# Altium schematic sheet ZYNQ_PL_Bank_33.SchDoc
size A4; DocumentNumber: 5; SheetNumber: 5; SheetTotal: 47
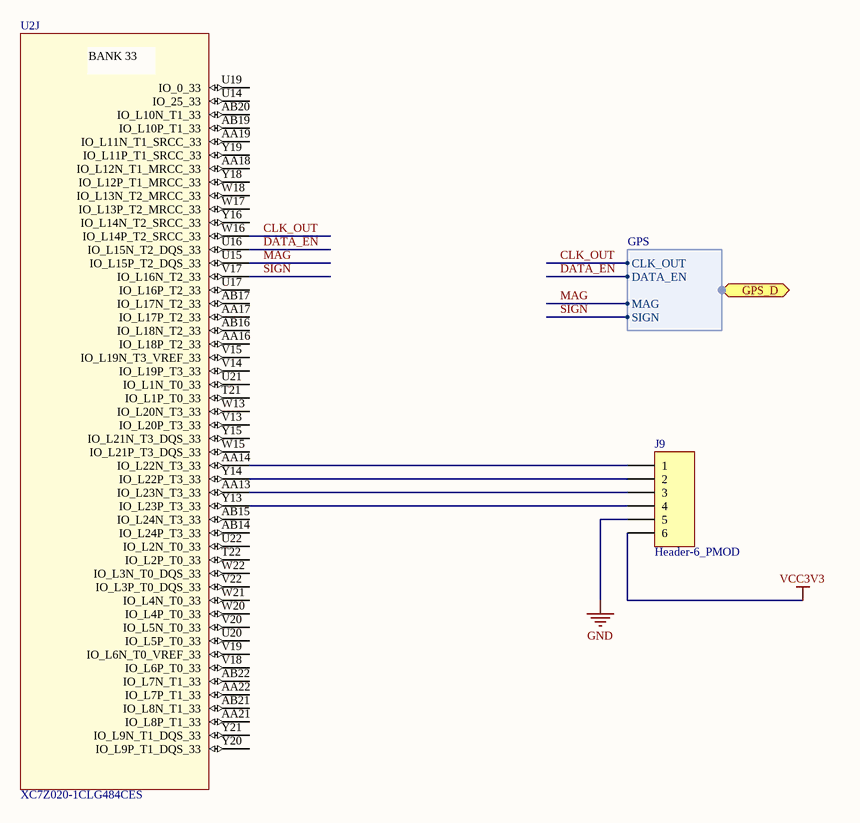
[diagram p0: ZYNQ_PL_Bank_33.SchDoc]

## Parts
J9  Header-6_PMOD  [ConnectorGPIO_Sullins_PPTC061LGBN-RC_6-pos]
U2  XC7Z020-1CLG484CES  [ZYNQ_xc7z020clg484pkg_BGA-484]  (part J of 10)

## Ports
GPS_D (harness GPS)

## Harnesses
GPS: CLK_OUT, DATA_EN, MAG, SIGN

## Nets
GND: J9.5
VCC3V3: J9.6
CLK_OUT: U2.W16(IO_L14P_T2_SRCC_33) ; port GPS_D.CLK_OUT
DATA_EN: U2.U16(IO_L15N_T2_DQS_33) ; port GPS_D.DATA_EN
MAG: U2.U15(IO_L15P_T2_DQS_33) ; port GPS_D.MAG
SIGN: U2.V17(IO_L16N_T2_33) ; port GPS_D.SIGN
NetJ9_1: J9.1 U2.AA14(IO_L22N_T3_33)
NetJ9_2: J9.2 U2.Y14(IO_L22P_T3_33)
NetJ9_3: J9.3 U2.AA13(IO_L23N_T3_33)
NetJ9_4: J9.4 U2.Y13(IO_L23P_T3_33)

Not connected (* = marked no-connect by the designer): U2 AA16(IO_L18P_T2_33) AA17(IO_L17P_T2_33) AA18(IO_L12N_T1_MRCC_33) AA19(IO_L11N_T1_SRCC_33) AA21(IO_L8P_T1_33) AA22(IO_L7P_T1_33) AB14(IO_L24P_T3_33) AB15(IO_L24N_T3_33) AB16(IO_L18N_T2_33) AB17(IO_L17N_T2_33) AB19(IO_L10P_T1_33) AB20(IO_L10N_T1_33) AB21(IO_L8N_T1_33) AB22(IO_L7N_T1_33) T21(IO_L1P_T0_33) T22(IO_L2P_T0_33) U14(IO_25_33) U17(IO_L16P_T2_33) U19(IO_0_33) U20(IO_L5P_T0_33) U21(IO_L1N_T0_33) U22(IO_L2N_T0_33) V13(IO_L20P_T3_33) V14(IO_L19P_T3_33) V15(IO_L19N_T3_VREF_33) V18(IO_L6P_T0_33) V19(IO_L6N_T0_VREF_33) V20(IO_L5N_T0_33) V22(IO_L3P_T0_DQS_33) W13(IO_L20N_T3_33) W15(IO_L21P_T3_DQS_33) W17(IO_L13P_T2_MRCC_33) W18(IO_L13N_T2_MRCC_33) W20(IO_L4P_T0_33) W21(IO_L4N_T0_33) W22(IO_L3N_T0_DQS_33) Y15(IO_L21N_T3_DQS_33) Y16(IO_L14N_T2_SRCC_33) Y18(IO_L12P_T1_MRCC_33) Y19(IO_L11P_T1_SRCC_33) Y20(IO_L9P_T1_DQS_33) Y21(IO_L9N_T1_DQS_33)

## Notes on the sheet
- (in symbol XC7Z020-1CLG484CES, part J) BANK 33

## Library data of the parts
J9 = PPTC061LGBN-RC: CONN FEMALE 6POS .100" R/A TIN; Manufacturer: Sullins Connector Solutions; Part Number: PPTC061LGBN-RC
U2 = XC7Z020-1CLG484CES: XC7Z020-1CLG484CES, Zynq-7000 All Programmable SoC; Manufacturer: Xilinx; Part Number: XC7Z020-1CLG484CES